# EAGLE design TicTacToe3D (EAGLE 6.1)
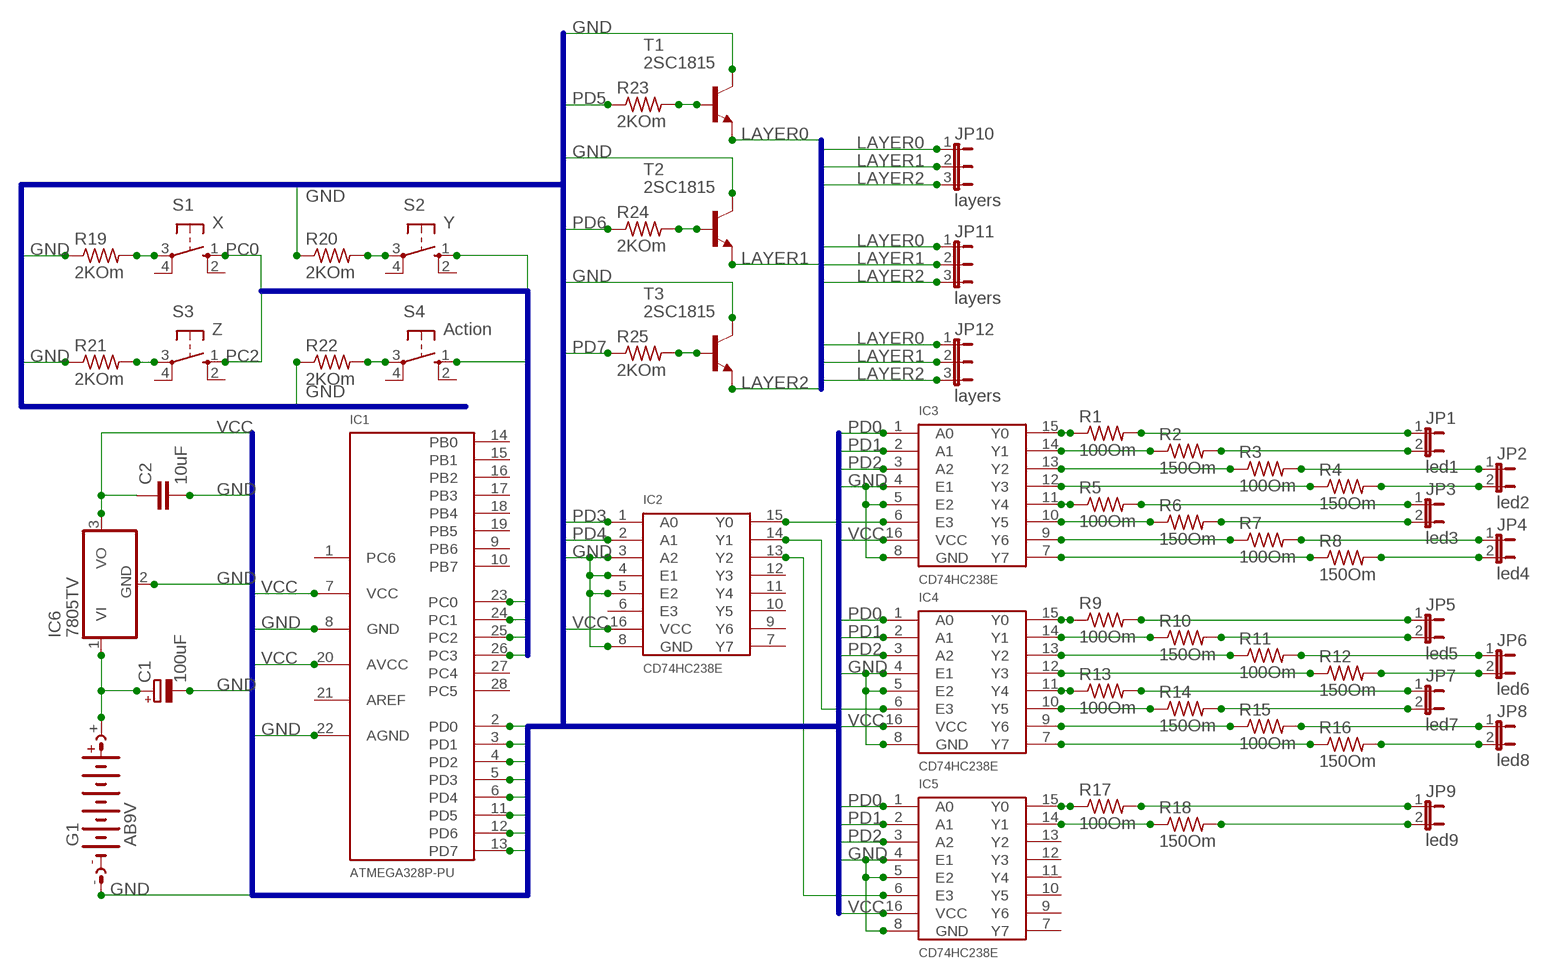
[diagram p0: schematic, sheet 1]

## Parts
C1  100uF  CPOL-EUE2-4  [E2-4]
C2  10uF  C-EU050-024X044  [C050-024X044]
G1  AB9V  [AB9V]
IC1  ATMEGA328P-PU  [28P3]
IC2  CD74HC238E  [16PDIP]
IC3  CD74HC238E  [16PDIP]
IC4  CD74HC238E  [16PDIP]
IC5  CD74HC238E  [16PDIP]
IC6  7805TV  [TO220V]
JP1  led1  JP1E  [JP1]
JP2  led2  JP1E  [JP1]
JP3  led3  JP1E  [JP1]
JP4  led4  JP1E  [JP1]
JP5  led5  JP1E  [JP1]
JP6  led6  JP1E  [JP1]
JP7  led7  JP1E  [JP1]
JP8  led8  JP1E  [JP1]
JP9  led9  JP1E  [JP1]
JP10  layers  JP2E  [JP2]
JP11  layers  JP2E  [JP2]
JP12  layers  JP2E  [JP2]
R1  100Om  R-US_0204/7  [0204/7]
R2  150Om  R-US_0204/7  [0204/7]
R3  100Om  R-US_0204/7  [0204/7]
R4  150Om  R-US_0204/7  [0204/7]
R5  100Om  R-US_0204/7  [0204/7]
R6  150Om  R-US_0204/7  [0204/7]
R7  100Om  R-US_0204/7  [0204/7]
R8  150Om  R-US_0204/7  [0204/7]
R9  100Om  R-US_0204/7  [0204/7]
R10  150Om  R-US_0204/7  [0204/7]
R11  100Om  R-US_0204/7  [0204/7]
R12  150Om  R-US_0204/7  [0204/7]
R13  100Om  R-US_0204/7  [0204/7]
R14  150Om  R-US_0204/7  [0204/7]
R15  100Om  R-US_0204/7  [0204/7]
R16  150Om  R-US_0204/7  [0204/7]
R17  100Om  R-US_0204/7  [0204/7]
R18  150Om  R-US_0204/7  [0204/7]
R19  2KOm  R-US_0204/7  [0204/7]
R20  2KOm  R-US_0204/7  [0204/7]
R21  2KOm  R-US_0204/7  [0204/7]
R22  2KOm  R-US_0204/7  [0204/7]
R23  2KOm  R-US_0204/7  [0204/7]
R24  2KOm  R-US_0204/7  [0204/7]
R25  2KOm  R-US_0204/7  [0204/7]
S1  X  10-XX  [B3F-10XX]
S2  Y  10-XX  [B3F-10XX]
S3  Z  10-XX  [B3F-10XX]
S4  Action  10-XX  [B3F-10XX]
T1  2SC1815  [TO92-ECB]
T2  2SC1815  [TO92-ECB]
T3  2SC1815  [TO92-ECB]

## Nets
GND: C1.- C2.2 G1.- IC1.8(GND) IC1.22(AGND) IC2.3(A2) IC2.4(E1) IC2.5(E2) IC2.8(GND) IC3.4(E1) IC3.5(E2) IC3.8(GND) IC4.4(E1) IC4.5(E2) IC4.8(GND) IC5.4(E1) IC5.5(E2) IC5.8(GND) IC6.2(GND) R19.1 R20.1 R21.1 R22.1 T1.C T2.C T3.C
LAYER0: JP10.1 JP11.1 JP12.1 T1.E
LAYER1: JP10.2 JP11.2 JP12.2 T2.E
LAYER2: JP10.3 JP11.3 JP12.3 T3.E
N$1: C1.+ G1.+ IC6.1(VI)
N$2: IC2.15(Y0) IC3.6(E3)
N$3: IC2.14(Y1) IC4.6(E3)
N$4: IC2.13(Y2) IC5.6(E3)
N$5: IC3.15(Y0) R1.1
N$6: IC3.14(Y1) R2.1
N$7: IC3.12(Y3) R4.1
N$8: IC3.13(Y2) R3.1
N$9: IC5.14(Y1) R18.1
N$10: R19.2 S1.3(P)
N$11: R20.2 S2.3(P)
N$12: R21.2 S3.3(P)
N$13: IC3.11(Y4) R5.1
N$14: IC3.10(Y5) R6.1
N$15: IC3.9(Y6) R7.1
N$16: IC3.7(Y7) R8.1
N$17: R22.2 S4.3(P)
N$18: R24.2 T2.B
N$19: R25.2 T3.B
N$20: R23.2 T1.B
N$21: JP1.2 R2.2
N$22: JP2.2 R4.2
N$23: JP3.2 R6.2
N$24: JP4.2 R8.2
N$25: JP5.2 R10.2
N$26: JP6.2 R12.2
N$27: JP7.2 R14.2
N$28: JP8.2 R16.2
N$29: IC4.15(Y0) R9.1
N$30: IC4.14(Y1) R10.1
N$31: IC4.13(Y2) R11.1
N$32: IC4.12(Y3) R12.1
N$33: IC4.11(Y4) R13.1
N$34: IC4.10(Y5) R14.1
N$35: IC4.9(Y6) R15.1
N$36: IC4.7(Y7) R16.1
N$37: IC5.15(Y0) R17.1
N$38: JP9.2 R18.2
N$39: JP1.1 R1.2
N$40: JP2.1 R3.2
N$41: JP3.1 R5.2
N$42: JP4.1 R7.2
N$43: JP5.1 R9.2
N$44: JP6.1 R11.2
N$45: JP7.1 R13.2
N$46: JP8.1 R15.2
N$47: JP9.1 R17.2
PC0: IC1.23(PC0) S1.1(S)
PC1: IC1.24(PC1) S2.1(S)
PC2: IC1.25(PC2) S3.1(S)
PC3: IC1.26(PC3) S4.1(S)
PD0: IC1.2(PD0) IC3.1(A0) IC4.1(A0) IC5.1(A0)
PD1: IC1.3(PD1) IC3.2(A1) IC4.2(A1) IC5.2(A1)
PD2: IC1.4(PD2) IC3.3(A2) IC4.3(A2) IC5.3(A2)
PD3: IC1.5(PD3) IC2.1(A0)
PD4: IC1.6(PD4) IC2.2(A1)
PD5: IC1.11(PD5) R23.1
PD6: IC1.12(PD6) R24.1
PD7: IC1.13(PD7) R25.1
VCC: C2.1 IC1.7(VCC) IC1.20(AVCC) IC2.16(VCC) IC3.16(VCC) IC4.16(VCC) IC5.16(VCC) IC6.3(VO)
Unconnected: IC1.1(PC6) IC1.9(PB6) IC1.10(PB7) IC1.14(PB0) IC1.15(PB1) IC1.16(PB2) IC1.17(PB3) IC1.18(PB4) IC1.19(PB5) IC1.21(AREF) IC1.27(PC4) IC1.28(PC5) IC2.6(E3) IC2.7(Y7) IC2.9(Y6) IC2.10(Y5) IC2.11(Y4) IC2.12(Y3) IC5.7(Y7) IC5.9(Y6) IC5.10(Y5) IC5.11(Y4) IC5.12(Y3) IC5.13(Y2) S1.2(S1) S1.4(P1) S2.2(S1) S2.4(P1) S3.2(S1) S3.4(P1) S4.2(S1) S4.4(P1)

## Buses
PC[0..3]
PD[0..7],GND,VCC
LAYER[0..2]

## Library data of the parts
C1 = rcl:CPOL-EU: POLARIZED CAPACITOR, European symbol
C2 = resistor:C-EU: CAPACITOR, European symbol
G1 = battery:AB9V: 9-V BATTERY CLIP
IC1 = TicTakToe3D:ATMEGA328P: Datasheet <http://www.atmel.com/Images/8161s.pdf>
IC2-IC5 = TicTakToe3D:CD74HC238: Darasheet <http://www.ti.com/lit/ds/symlink/cd54hc238.pdf>
IC6 = linear:78*: Positive VOLTAGE REGULATOR Source: http://cache.national.com/ds/LM/LM78L05.pdf http://www.fairchildsemi.com/ds/LM/LM7805.pdf
JP1-JP9 = jumper:JP1E: JUMPER
JP10-JP12 = jumper:JP2E: JUMPER
R1-R25 = rcl:R-US_: RESISTOR, American symbol
S1-S4 = switch-omron:10-XX: OMRON SWITCH; MPN: B3F-1000; OC_FARNELL: 176432; OC_NEWARK: 36M3542
T1-T3 = transistor:2SC1815: NPN EPITAXIAL TRANSISTOR Source: TOSHIBA .. 2SC1815 1.pdf

## Board
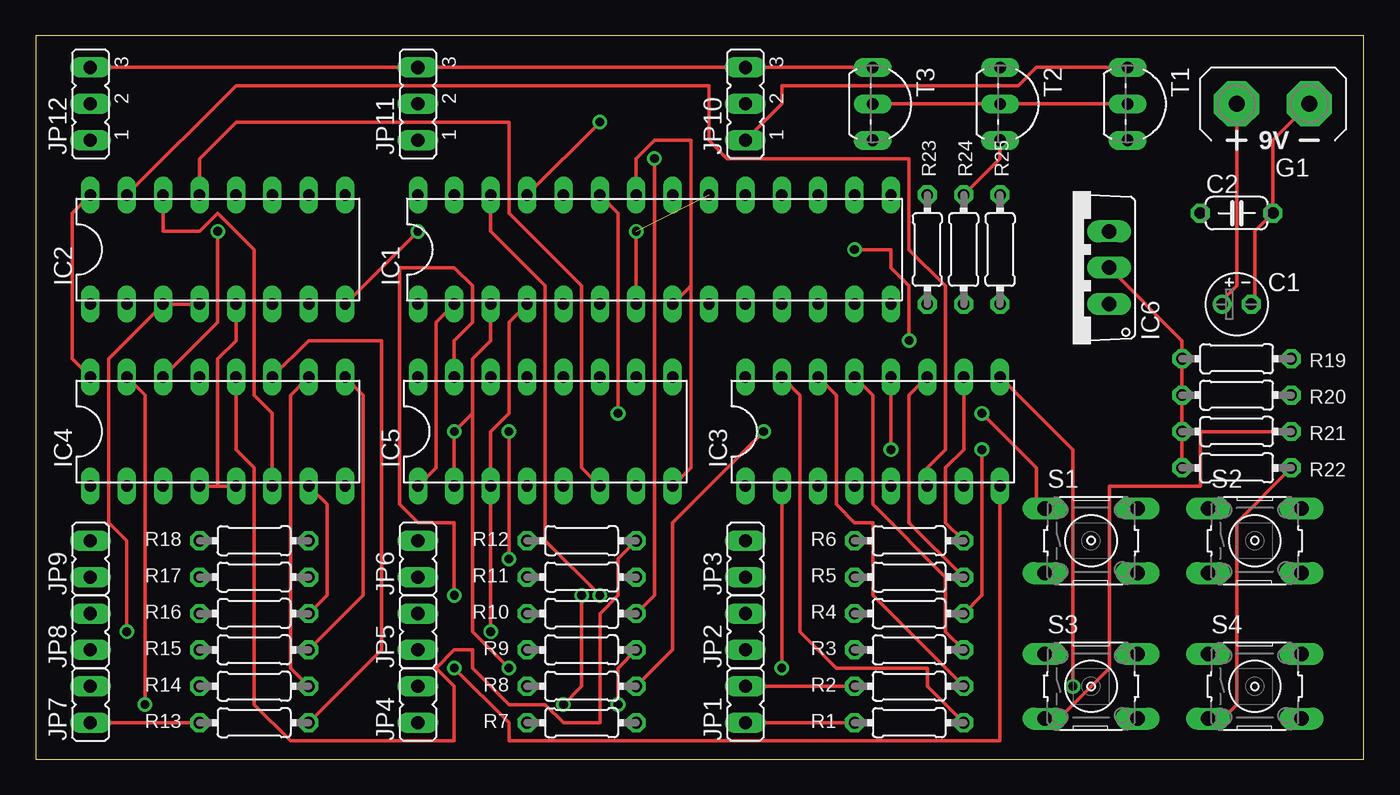
[diagram p1: board, top side]
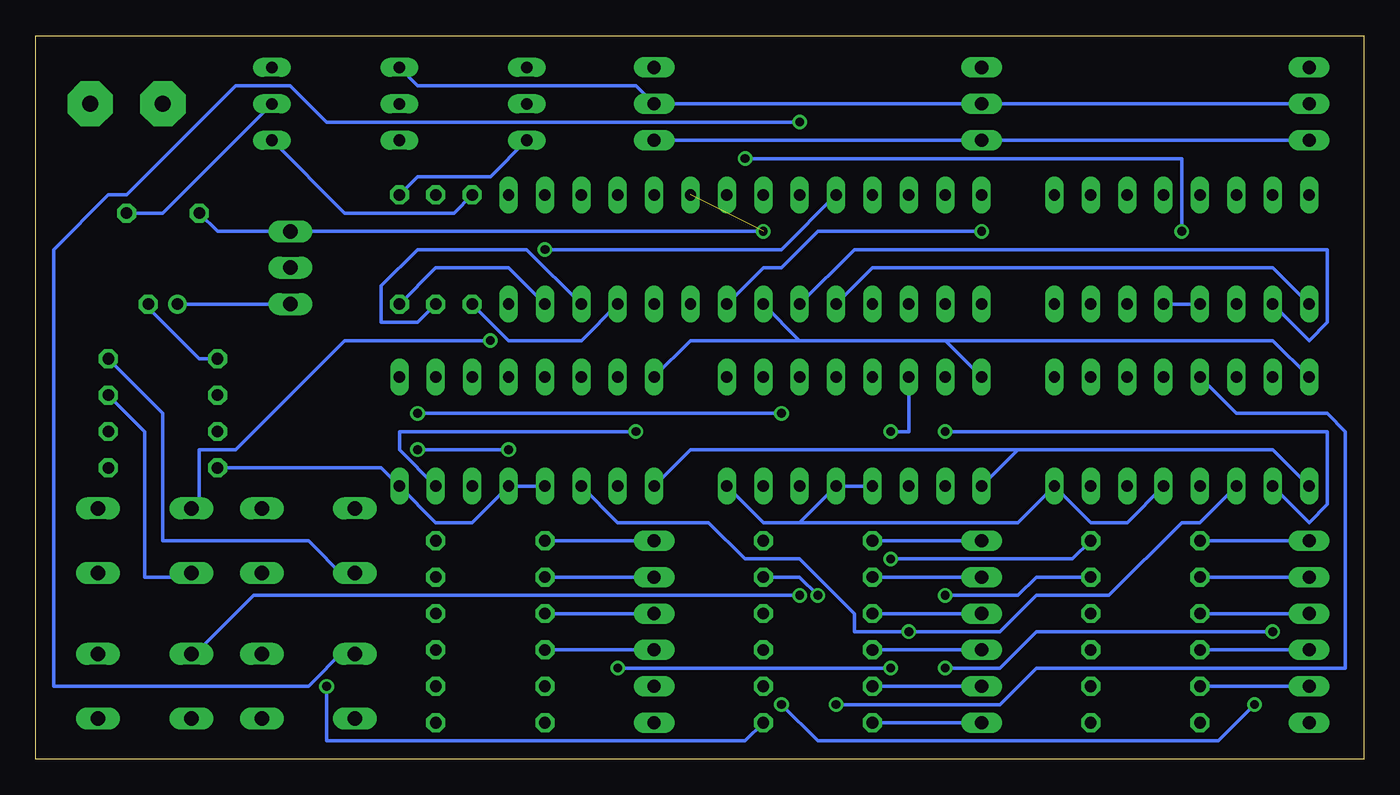
[diagram p2: board, bottom side, seen from below]

Size 92.69 x 50.47 mm. Coordinates in mm from the lower left corner, seen from the top.
Outline: 0,0 92.69,0 92.69,50.47 0,50.47 0,0
Copper layers (1*16): Top 0.035mm / dielectric 1.5mm / Bottom 0.035mm
Design rules: minimum track width 10mil, minimum drill 24mil, track to track 8mil, track to pad 8mil, pad to pad 8mil, via to via 8mil, smd to smd 8mil, copper to edge 40mil, drill to drill 8mil, minimum pad ring 10mil, minimum via ring 8mil, stop-mask expansion 4mil, vias tented up to drill 0mil, thermal gap 10mil

### Footprints (pad centres in the part's own frame; a part is rotated, then mirrored left to right if it is on the bottom)
E2-4 = drill 0.813 pad 1.27: + -1.016,0 | drill 0.813 pad 1.27 octagon: - 1.016,0
C050-024X044 = drill 0.813 octagon: 1 -2.54,0; 2 2.54,0
AB9V = drill 1.118 pad 3.15 octagon: + 0,2.54; - 0,-2.54
28P3 = drill 0.8 long: 1 -16.51,-3.81; 2 -13.97,-3.81; 3 -11.43,-3.81; 4 -8.89,-3.81; 5 -6.35,-3.81; 6 -3.81,-3.81; 7 -1.27,-3.81; 8 1.27,-3.81; 9 3.81,-3.81; 10 6.35,-3.81; 11 8.89,-3.81; 12 11.43,-3.81; 13 13.97,-3.81; 14 16.51,-3.81; 15 16.51,3.81; 16 13.97,3.81; 17 11.43,3.81; 18 8.89,3.81; 19 6.35,3.81; 20 3.81,3.81; 21 1.27,3.81; 22 -1.27,3.81; 23 -3.81,3.81; 24 -6.35,3.81; 25 -8.89,3.81; 26 -11.43,3.81; 27 -13.97,3.81; 28 -16.51,3.81
16PDIP = drill 0.8 long: 1 -8.89,-3.81; 2 -6.35,-3.81; 3 -3.81,-3.81; 4 -1.27,-3.81; 5 1.27,-3.81; 6 3.81,-3.81; 7 6.35,-3.81; 8 8.89,-3.81; 9 8.89,3.81; 10 6.35,3.81; 11 3.81,3.81; 12 1.27,3.81; 13 -1.27,3.81; 14 -3.81,3.81; 15 -6.35,3.81; 16 -8.89,3.81
TO220V = drill 1.016 long: 1 -2.54,-2.54; 2 0,-2.54; 3 2.54,-2.54
JP1 = drill 0.914 long: 1 0,-1.27; 2 0,1.27
JP2 = drill 0.914 long: 1 -2.54,0; 2 0,0; 3 2.54,0
0204/7 = drill 0.813 octagon: 1 -3.81,0; 2 3.81,0
B3F-10XX = drill 1.016 long: 1 -3.251,2.261; 2 3.251,2.261; 3 -3.251,-2.261; 4 3.251,-2.261
TO92-ECB = drill 0.813 long: B 2.54,0; C 0,0; E -2.54,0

### Placement (x,y rotation side)
C1  83.82,31.75 0 top
C2  83.82,38.1 0 top
G1  86.36,45.72 90 top
IC1  43.18,35.56 0 top
IC2  12.7,35.56 0 top
IC3  58.42,22.86 0 top
IC4  12.7,22.86 0 top
IC5  35.56,22.86 0 top
IC6  72.39,34.29 90 top
JP1  49.53,3.81 0 top
JP2  49.53,8.89 0 top
JP3  49.53,13.97 0 top
JP4  26.67,3.81 0 top
JP5  26.67,8.89 0 top
JP6  26.67,13.97 0 top
JP7  3.81,3.81 0 top
JP8  3.81,8.89 0 top
JP9  3.81,13.97 0 top
JP10  49.53,45.72 90 top
JP11  26.67,45.72 90 top
JP12  3.81,45.72 90 top
R1  60.96,2.54 180 top
R2  60.96,5.08 180 top
R3  60.96,7.62 180 top
R4  60.96,10.16 180 top
R5  60.96,12.7 180 top
R6  60.96,15.24 180 top
R7  38.1,2.54 180 top
R8  38.1,5.08 180 top
R9  38.1,7.62 180 top
R10  38.1,10.16 180 top
R11  38.1,12.7 180 top
R12  38.1,15.24 180 top
R13  15.24,2.54 180 top
R14  15.24,5.08 180 top
R15  15.24,7.62 180 top
R16  15.24,10.16 180 top
R17  15.24,12.7 180 top
R18  15.24,15.24 180 top
R19  83.82,27.94 0 top
R20  83.82,25.4 0 top
R21  83.82,22.86 0 top
R22  83.82,20.32 0 top
R23  62.23,35.56 90 top
R24  64.77,35.56 90 top
R25  67.31,35.56 90 top
S1  73.66,15.24 0 top
S2  85.09,15.24 0 top
S3  73.66,5.08 0 top
S4  85.09,5.08 0 top
T1  76.2,45.72 270 top
T2  67.31,45.72 270 top
T3  58.42,45.72 270 top

### Tracks (layer width: path | path; a pad name or v marks a point on that pad's centre or on a via)
GND  (via drill 0.61)
  Top 0.254: IC2.4 IC2.3 5.08,27.94 5.08,16.51 6.35,15.24 v6.35,8.89 | IC4.5 12.7,19.05 | 12.7,19.05 IC4.4 | IC2.5 13.97,29.21 12.7,27.94 12.7,19.05 | v26.67,36.83 IC2.8 | IC1.22 41.91,41.91 43.18,43.18 45.72,43.18 45.72,33.02 | IC1.8 45.72,33.02 | IC5.8 45.72,20.32 45.72,33.02 | T3.C T2.C T1.C | C1.- 85.09,31.75 85.09,36.83 C2.2 86.36,43.18 G1.- | IC6.2 80.01,29.21 R19.1 R20.1 R21.1 R22.1 | v29.21,6.35 33.02,2.54 33.02,1.27 67.31,1.27 IC3.8
  Bottom 0.254: IC2.4 IC2.5 | IC4.5 16.51,16.51 19.05,16.51 IC4.8 24.13,16.51 39.37,16.51 | IC5.4 IC5.5 39.37,16.51 | IC5.8 41.91,16.51 39.37,16.51 | v26.67,36.83 38.1,36.83 40.64,34.29 41.91,34.29 IC1.8 | IC3.4 IC3.5 62.23,16.51 64.77,16.51 IC3.8 68.58,20.32 R22.1 | R19.1 81.28,27.94 85.09,31.75 C1.- | T1.C 83.82,38.1 C2.2 | v6.35,8.89 22.86,8.89 25.4,6.35 v29.21,6.35
LAYER0
  Top 0.254: T1.E 69.85,48.26 68.58,46.99 52.07,46.99 52.07,45.72 JP10.1
  Bottom 0.254: JP12.1 JP11.1 JP10.1
LAYER1
  Bottom 0.254: T2.E 66.04,46.99 50.8,46.99 JP10.2 JP11.2 JP12.2
LAYER2
  Top 0.254: T3.E JP10.3 JP11.3 JP12.3
N$1
  Top 0.254: G1.+ 83.82,33.02 82.55,31.75 C1.+
  Bottom 0.254: IC6.1 C1.+
N$2
  Top 0.254: IC2.15 13.97,46.99 46.99,46.99 46.99,43.18 48.26,41.91 60.96,41.91 60.96,35.56 63.5,33.02 63.5,21.59 62.23,20.32 IC3.6
N$3
  Top 0.254: IC4.6 16.51,24.13 15.24,25.4 15.24,35.56 12.7,38.1 11.43,36.83 8.89,36.83 IC2.14
N$4
  Top 0.254: IC2.13 11.43,41.91 13.97,44.45 33.02,44.45 33.02,38.1 38.1,33.02 38.1,20.32 IC5.6
N$5
  Top 0.254: IC3.15 53.34,25.4 53.34,8.89 55.88,6.35 62.23,6.35 62.23,5.08 R1.1
N$6
  Top 0.254: IC3.14 55.88,25.4 55.88,17.78 57.15,16.51 58.42,16.51 58.42,11.43 R2.1
N$7  (via drill 0.61)
  Top 0.254: v59.69,21.59 IC3.12 | v66.04,21.59 66.04,11.43 R4.1
  Bottom 0.254: v66.04,21.59 v59.69,21.59
N$8
  Top 0.254: IC3.13 58.42,25.4 58.42,17.78 63.5,12.7 63.5,8.89 R3.1
N$9  (via drill 0.61)
  Top 0.254: v33.02,13.97 v33.02,22.86
  Bottom 0.254: IC5.14 31.75,22.86 v33.02,22.86 | v33.02,13.97 20.32,13.97 R18.1
N$10
  Bottom 0.254: R19.2 83.82,24.13 83.82,15.24 73.66,15.24 71.12,12.7 S1.3
N$11
  Bottom 0.254: R20.2 85.09,22.86 85.09,12.7 82.55,12.7 S2.3
N$12
  Top 0.254: R21.2 81.28,22.86 81.28,19.05 74.93,19.05 74.93,6.35 71.12,2.54 S3.3
N$13
  Top 0.254: IC3.11 60.96,25.4 60.96,16.51 R5.1
N$14
  Top 0.254: IC3.10 64.77,21.59 63.5,20.32 63.5,16.51 R6.1
N$15  (via drill 0.61)
  Top 0.254: IC3.9 72.39,21.59 v72.39,5.08
  Bottom 0.254: v72.39,5.08 72.39,1.27 43.18,1.27 R7.1
N$16  (via drill 0.61)
  Top 0.254: v50.8,22.86 44.45,16.51 44.45,7.62 R8.1
  Bottom 0.254: IC3.7 67.31,21.59 67.31,22.86 v50.8,22.86
N$17
  Top 0.254: R22.2 83.82,16.51 83.82,3.81 82.55,2.54 S4.3
N$18
  Top 0.254: R24.2 67.31,41.91 T2.B
N$19
  Bottom 0.254: T3.B 60.96,40.64 66.04,40.64 R25.2
N$20
  Bottom 0.254: R23.2 63.5,38.1 71.12,38.1 T1.B
N$21
  Top 0.254: JP1.2 R2.2
N$22
  Bottom 0.254: JP2.2 R4.2
N$23
  Bottom 0.254: JP3.2 R6.2
N$24
  Bottom 0.254: JP4.2 R8.2
N$25
  Bottom 0.254: JP5.2 R10.2
N$26
  Bottom 0.254: JP6.2 R12.2
N$27
  Bottom 0.254: JP7.2 R14.2
N$28
  Bottom 0.254: JP8.2 R16.2
N$29  (via drill 0.61)
  Top 0.254: IC4.15 7.62,25.4 v7.62,3.81 | v40.64,3.81 40.64,6.35 R9.1
  Bottom 0.254: v7.62,3.81 10.16,1.27 38.1,1.27 v40.64,3.81
N$30  (via drill 0.61)
  Top 0.254: IC4.14 12.7,30.48 v12.7,36.83 | v43.18,41.91 43.18,11.43 R10.1
  Bottom 0.254: v12.7,36.83 12.7,41.91 v43.18,41.91
N$31  (via drill 0.61)
  Top 0.254: v36.83,3.81 38.1,5.08 v38.1,11.43
  Bottom 0.254: IC4.13 8.89,24.13 2.54,24.13 1.27,22.86 1.27,6.35 22.86,6.35 25.4,3.81 v36.83,3.81 | v38.1,11.43 39.37,12.7 R11.1
N$32
  Top 0.254: IC4.12 13.97,21.59 15.24,20.32 15.24,3.81 17.78,1.27 29.21,1.27 29.21,5.08 27.94,6.35 29.21,7.62 30.48,7.62 30.48,6.35 33.02,3.81 35.56,3.81 36.83,2.54 39.37,2.54 39.37,10.16 40.64,11.43 40.64,13.97 R12.1
N$33
  Top 0.254: IC4.11 19.05,29.21 24.13,29.21 24.13,7.62 R13.1
N$34
  Top 0.254: IC4.10 17.78,25.4 17.78,6.35 R14.1
N$35
  Top 0.254: IC4.9 22.86,25.4 22.86,11.43 R15.1
N$36
  Top 0.254: IC4.7 20.32,17.78 20.32,11.43 R16.1
N$37  (via drill 0.61)
  Top 0.254: IC5.15 29.21,29.21 30.48,30.48 30.48,33.02 29.21,34.29 25.4,34.29 25.4,17.78 26.67,16.51 29.21,16.51 v29.21,11.43
  Bottom 0.254: v29.21,11.43 24.13,11.43 22.86,12.7 R17.1
N$38
  Bottom 0.254: JP9.2 R18.2
N$39
  Top 0.254: JP1.1 R1.2
N$40
  Bottom 0.254: JP2.1 R3.2
N$41
  Bottom 0.254: JP3.1 R5.2
N$42
  Bottom 0.254: JP4.1 R7.2
N$43
  Bottom 0.254: JP5.1 R9.2
N$44
  Bottom 0.254: JP6.1 R11.2
N$45
  Top 0.254: JP7.1 R13.2
N$46
  Bottom 0.254: JP8.1 R15.2
N$47
  Bottom 0.254: JP9.1 R17.2
PC0  (via drill 0.61)
  Top 0.254: IC1.23 40.64,38.1 v40.64,24.13 | v66.04,24.13 69.85,20.32 69.85,17.78 S1.1
  Bottom 0.254: v66.04,24.13 v40.64,24.13
PC1  (via drill 0.61)
  Top 0.254: v57.15,35.56 59.69,35.56 59.69,34.29 60.96,33.02 v60.96,29.21
  Bottom 0.254: IC1.24 40.64,35.56 v57.15,35.56 | v60.96,29.21 71.12,29.21 78.74,21.59 81.28,21.59 81.28,17.78 S2.1
PC2  (via drill 0.61)
  Top 0.254: v39.37,44.45 IC1.25
  Bottom 0.254: v39.37,44.45 72.39,44.45 74.93,46.99 78.74,46.99 86.36,39.37 87.63,39.37 91.44,35.56 91.44,5.08 73.66,5.08 71.12,7.62 S3.1
PC3  (via drill 0.61)
  Top 0.254: IC1.26 31.75,36.83 35.56,33.02 35.56,15.24 v39.37,11.43
  Bottom 0.254: v39.37,11.43 77.47,11.43 81.28,7.62 S4.1
PD0
  Top 0.254: IC1.2 27.94,30.48 27.94,20.32 IC5.1
  Bottom 0.254: IC4.1 6.35,21.59 24.13,21.59 | IC5.1 24.13,21.59 | IC3.1 46.99,21.59 24.13,21.59
PD1  (via drill 0.61)
  Top 0.254: IC5.2 v29.21,22.86 30.48,24.13 | IC1.3 31.75,29.21 30.48,27.94 30.48,24.13 | v52.07,6.35 IC3.2 | v33.02,6.35 30.48,8.89 30.48,24.13
  Bottom 0.254: IC4.2 3.81,16.51 2.54,17.78 2.54,22.86 v29.21,22.86 | v33.02,6.35 v52.07,6.35
PD2  (via drill 0.61)
  Top 0.254: v31.75,8.89 IC5.3 31.75,22.86 33.02,24.13 33.02,30.48 IC1.4
  Bottom 0.254: IC4.3 11.43,16.51 12.7,16.51 17.78,11.43 22.86,11.43 25.4,8.89 v31.75,8.89 35.56,8.89 35.56,10.16 39.37,13.97 43.18,13.97 45.72,16.51 52.07,16.51 IC3.3
PD3
  Bottom 0.254: IC2.1 6.35,34.29 34.29,34.29 IC1.5
PD4
  Bottom 0.254: IC2.2 3.81,29.21 2.54,30.48 2.54,35.56 35.56,35.56 IC1.6
PD5
  Bottom 0.254: IC1.11 54.61,29.21 59.69,29.21 R23.1
PD6
  Bottom 0.254: IC1.12 58.42,35.56 66.04,35.56 68.58,33.02 68.58,30.48 66.04,30.48 R24.1
PD7
  Bottom 0.254: IC1.13 59.69,34.29 64.77,34.29 R25.1
VCC  (via drill 0.61)  (1 unrouted)
  Top 0.254: IC4.16 2.54,27.94 2.54,38.1 IC2.16 | IC1.7 v41.91,36.83
  Bottom 0.254: C2.1 80.01,36.83 IC6.3 v41.91,36.83 | 29.21,29.21 IC5.16 | 39.37,29.21 29.21,29.21 | IC1.7 39.37,29.21 | IC3.16 46.99,29.21 39.37,29.21 | IC4.16 6.35,29.21 29.21,29.21